# Altium schematic sheet FingerPrint_Device_PCB.SchDoc
size A4; SheetNumber: 1; SheetTotal: 1
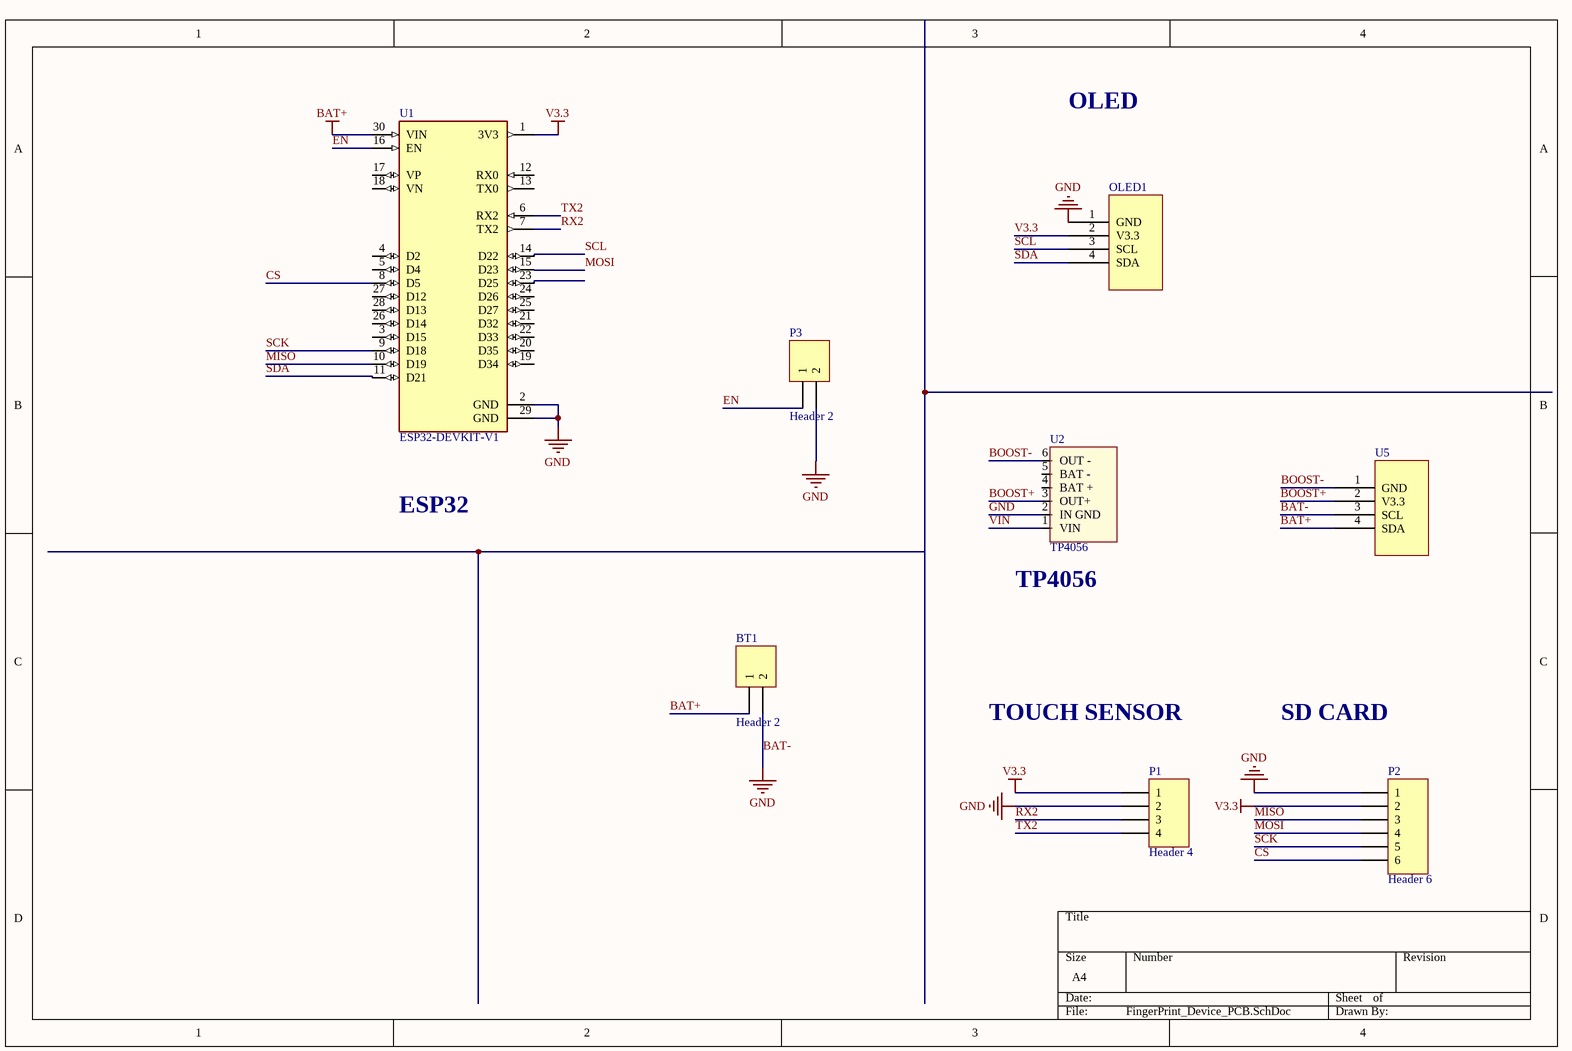
[diagram p0: FingerPrint_Device_PCB.SchDoc]

## Parts
BT1  Header 2  [HDR1X2]
OLED1  OLED  [OLED]  (value not drawn)
P1  Header 4  [HDR1X4]
P2  Header 6  [HDR1X6]
P3  Header 2  [HDR1X2]
U1  ESP32-DEVKIT-V1  [MODULE_ESP32_DEVKIT_V1]
U2  TP4056  [tp4056]
U5  OLED  [MT3608]  (value not drawn)

## Nets
BAT+: BT1.1 U1.30(VIN) U5.4(SDA)
BAT-: BT1.2 OLED1.1(GND) P1.2 P2.1 P3.2 U1.2(GND) U1.29(GND) U2.2(IN_GND) U5.3(SCL)  [also labelled GND]
V3.3: OLED1.2(V3.3) P1.1 P2.2 U1.1(3V3)
BOOST+: U2.3(OUT+) U5.2(V3.3)
BOOST-: U2.6(OUT_-) U5.1(GND)
CS: P2.6 U1.8(D5)
EN: P3.1 U1.16(EN)
MISO: P2.3 U1.10(D19)
MOSI: P2.4 U1.15(D23)
RX2: P1.3 U1.7(TX2)
SCK: P2.5 U1.9(D18)
SCL: OLED1.3(SCL) U1.14(D22)
SDA: OLED1.4(SDA) U1.11(D21)
TX2: P1.4 U1.6(RX2)
VIN: U2.1(VIN)

Not connected (* = marked no-connect by the designer): U1 3(D15) 4(D2) 5(D4) 12(RX0) 13(TX0) 17(VP) 18(VN) 19(D34) 20(D35) 21(D32) 22(D33) 23(D25) 24(D26) 25(D27) 26(D14) 27(D12) 28(D13); U2 4(BAT_+) 5(BAT_-)

## Notes on the sheet
- OLED
- ESP32
- (near U2) TP4056
- TOUCH SENSOR
- SD CARD

## Library data of the parts
BT1 P3 = Header 2: Header, 2-Pin; LatestRevisionDate: 17-Jul-2002; LatestRevisionNote: Re-released for DXP Platform.; Publisher: Altium Limited
P1 = Header 4: Header, 4-Pin; LatestRevisionDate: 17-Jul-2002; LatestRevisionNote: Re-released for DXP Platform.; Publisher: Altium Limited
P2 = Header 6: Header, 6-Pin; LatestRevisionDate: 17-Jul-2002; LatestRevisionNote: Re-released for DXP Platform.; Publisher: Altium Limited
U1 = ESP32-DEVKIT-V1: Dual core, Wi-Fi: 2.4 GHz up to 150 Mbits/s,BLE (Bluetooth Low Energy) and legacy Bluetooth, 32 bits, Up to 240 MHz; MF: Do it; Price: None; Availability: Not in stock; Package: None; MP: ESP32-DEVKIT-V1; Value: *; SnapEDA_Link: https://www.snapeda.com/parts/ESP32-DEVKIT-V1/Do+it/view-part/?ref=snap; Check_prices: https://www.snapeda.com/parts/ESP32-DEVKIT-V1/Do+it/view-part/?ref=eda
U2 = TP4056: Dushan